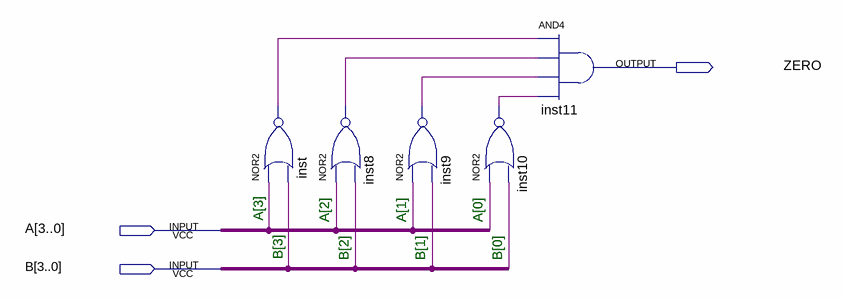
[diagram p0: schematic sheet]
// Quartus schematic comparadorZero.bdf as structural Verilog: 5 symbols, 3 pins
module comparadorZero (
  input  [3:0] A,
  input  [3:0] B,
  output ZERO
);

  wire inst8_out, inst9_out, inst10_out, inst_out;

  nor inst (inst_out, A[3], B[3]);
  nor inst8 (inst8_out, A[2], B[2]);
  nor inst9 (inst9_out, A[1], B[1]);
  nor inst10 (inst10_out, A[0], B[0]);
  and inst11 (ZERO, inst_out, inst8_out, inst9_out, inst10_out);

  // Notes on the sheet:
  //   A[3]
  //   A[2]
  //   A[1]
  //   A[0]
  //   B[3]
  //   B[2]
  //   B[1]
  //   B[0]
endmodule
